# Altium schematic sheet schema_combo_ver.2.SchDoc
size A3; SheetNumber: 1; SheetTotal: 1
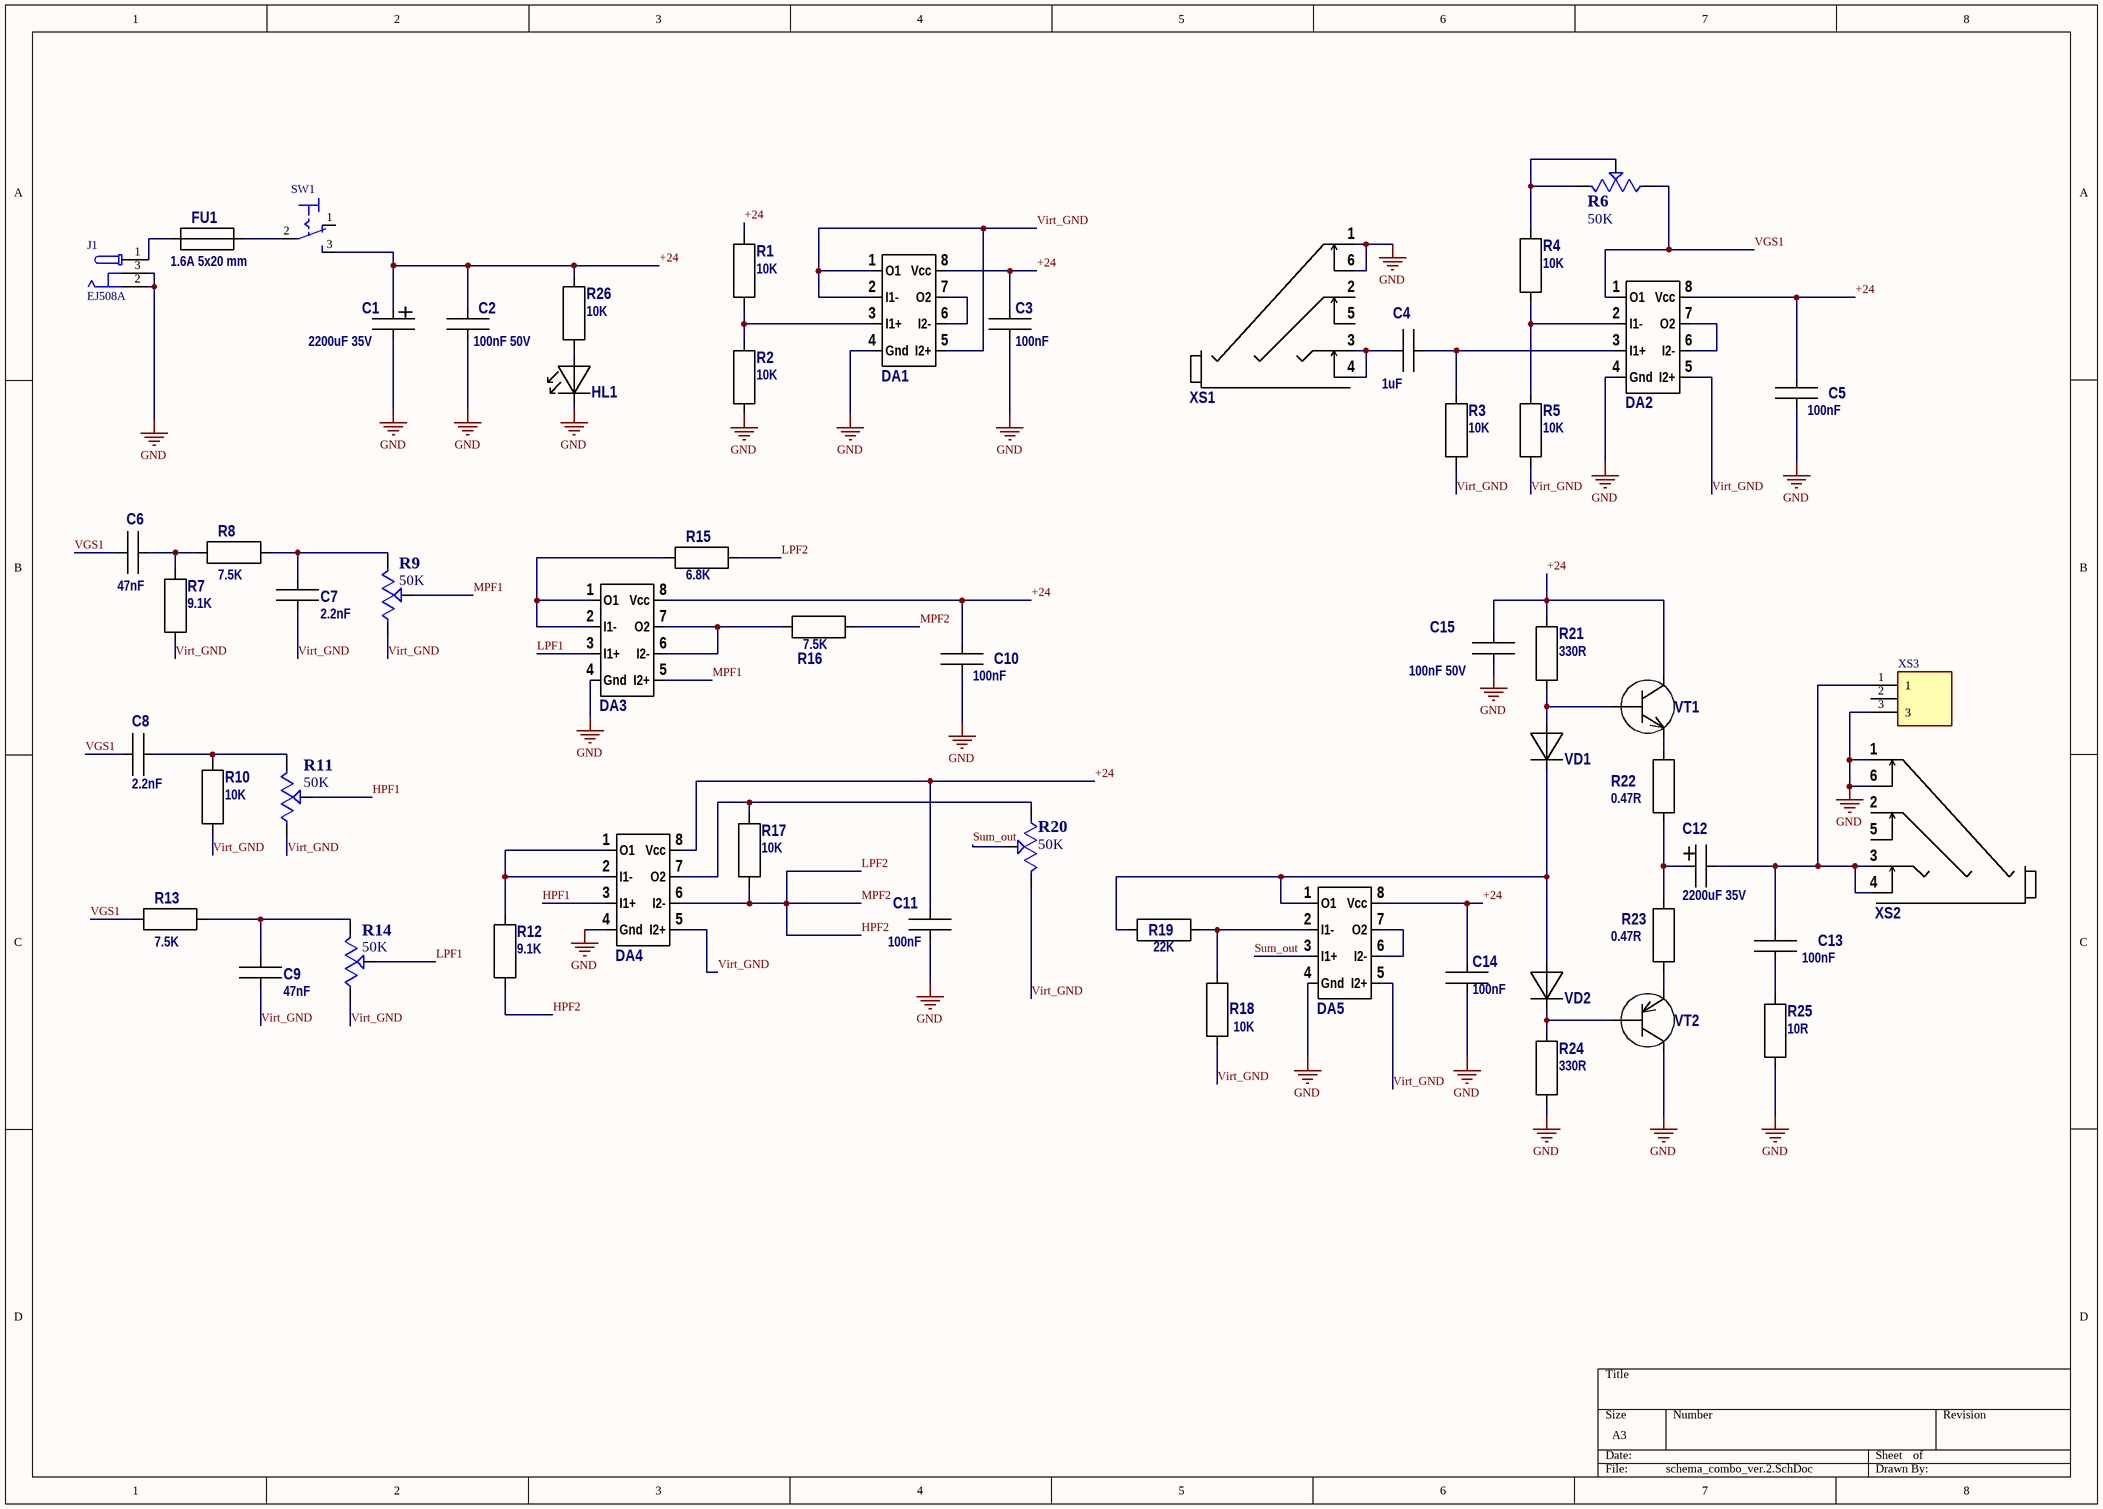
[diagram p0: schema_combo_ver.2.SchDoc]

## Parts
C1  2200uF 35V  [capr- 7.5D16.5H35]
C2  100nF 50V  [C__s 5-d 8-t4]
C3  100nF  [cap 1206 3D]
C4  1uF  [C__s 5-d 5.5-t4]
C5  100nF  [cap 1206 3D]
C6  47nF  [C__s10-d12.4-t4]
C7  2.2nF  [C__s10-d12.4-t4]
C8  2.2nF  [C__s10-d12.4-t4]
C9  47nF  [C__s10-d12.4-t4]
C10  100nF  [cap 1206 3D]
C11  100nF  [cap 1206 3D]
C12  2200uF 35V  [capr- 7.5D16.5H35]
C13  100nF  [C__s 5-d 7-t4]
C14  100nF  [cap 1206 3D]
C15  100nF 50V  [C__s 5-d 8-t4]
DA1  ОУ х 2 (1)  [DIP-8]  (value not drawn)
DA2  ОУ х 2 (1)  [DIP-8]  (value not drawn)
DA3  ОУ х 2 (1)  [DIP-8]  (value not drawn)
DA4  ОУ х 2 (1)  [DIP-8]  (value not drawn)
DA5  ОУ х 2 (1)  [DIP-8]  (value not drawn)
FU1  1.6A 5x20 mm  [FU_FC-001-N(DH)]
HL1  ???  [СД_D5_8.6_Y кр]  (value not drawn)
J1  EJ508A  [MPD_EJ508A]
R1  10K  [Res_1206 3D]
R2  10K  [Res_1206 3D]
R3  10K  [RES 0.25  L10]
R4  10K  [RES 0.25  L10]
R5  10K  [RES 0.25  L10]
R6  50K  [TRIM_WH148-1A-2-18T-L20]
R7  9.1K  [RES 0.25  L10]
R8  7.5K  [RES 0.25  L10]
R9  50K  [TRIM_WH148-1A-2-18T-L20]
R10  10K  [RES 0.25  L10]
R11  50K  [TRIM_WH148-1A-2-18T-L20]
R12  9.1K  [RES 0.25  L 5]
R13  7.5K  [RES 0.25  L10]
R14  50K  [TRIM_WH148-1A-2-18T-L20]
R15  6.8K  [RES 0.25  L 3,75]
R16  7.5K  [RES 0.25  L 3,75]
R17  10K  [RES 0.25  L 3,75]
R18  10K  [RES 0.25  L10]
R19  22K  [RES 0.25  L10]
R20  50K  [TRIM_WH148-1A-2-18T-L20]
R21  330R  [RES 0.5  L12,5]
R22  0.47R  [RES 1,0  L15]
R23  0.47R  [RES 1,0  L15]
R24  330R  [RES 0.5  L12,5]
R25  10R  [RES 0.25  L 5]
R26  10K  [Res_1206 3D]
SW1  MTS103  [MTS103]  (value not drawn)
VD1  Диод.  x1  (2)  [DO-35  (7.5)]  (value not drawn)
VD2  Диод.  x1  (2)  [DO-35  (7.5)]  (value not drawn)
VT1  VT NPN  [TO-220 (Z)]  (value not drawn)
VT2  VT PNP  [TO-220 (Z)]  (value not drawn)
XS1  NYS215  [Гнездо  NYS215]  (value not drawn)
XS2  NYS215  [Гнездо  NYS215]  (value not drawn)
XS3  MKDSN2,5/3-5.08  [PHOENIX_MKDSN2,5/3-5.08]  (value not drawn)

## Nets
GND: C1.1(-) C2.2 C3.2 C5.2 C10.2 C11.2 C14.2 C15.2 DA1.4(Gnd) DA2.4(Gnd) DA3.4(Gnd) DA4.4(Gnd) DA5.4(Gnd) HL1.1(K) J1.2 J1.3 R2.1 R24.1 R25.1 VT2.2(C) XS1.1 XS1.6 XS2.1 XS2.6 XS3.3
+24: C1.2(+) C2.1 C3.1 C5.1 C10.1 C11.1 C14.1 C15.1 DA1.8(Vcc) DA2.8(Vcc) DA3.8(Vcc) DA4.8(Vcc) DA5.8(Vcc) R1.2 R21.2 R26.2 SW1.3(S) VT1.2(C)
HPF1: DA4.3(I1+) R11.2
HPF2: DA4.6(I2-) R12.1 R15.2 R16.2 R17.1  [also labelled LPF2, MPF2]
LPF1: DA3.3(I1+) R14.2
MPF1: DA3.5(I2+) R9.2
Sum_out: DA5.3(I1+) R20.2
VGS1: C6.1 C8.2 DA2.1(O1) R6.1 R13.1
Virt_GND: C7.1 C9.1 DA1.1(O1) DA1.2(I1-) DA1.5(I2+) DA2.5(I2+) DA4.5(I2+) DA5.5(I2+) R3.1 R5.2 R7.1 R9.1 R10.2 R11.1 R14.1 R18.1 R20.1
NetC4_1: C4.1 DA2.3(I1+) R3.2
NetC4_2: C4.2 XS1.3 XS1.4
NetC6_2: C6.2 R7.2 R8.1
NetC7_2: C7.2 R8.2 R9.3
NetC8_1: C8.1 R10.1 R11.3
NetC9_2: C9.2 R13.2 R14.3
NetC12_1: C12.1(-) C13.1 XS2.3 XS2.4 XS3.1
NetC12_2: C12.2(+) R22.2 R23.2
NetC13_2: C13.2 R25.2
NetDA1_3: DA1.3(I1+) R1.1 R2.2
NetDA1_6: DA1.6(I2-) DA1.7(O2)
NetDA2_2: DA2.2(I1-) R4.2 R5.1
NetDA2_6: DA2.6(I2-) DA2.7(O2)
NetDA3_1: DA3.1(O1) DA3.2(I1-) R15.1
NetDA3_6: DA3.6(I2-) DA3.7(O2) R16.1
NetDA4_1: DA4.1(O1) DA4.2(I1-) R12.2
NetDA4_7: DA4.7(O2) R17.2 R20.3
NetDA5_1: DA5.1(O1) R19.1 VD1.1(K) VD2.2(A)
NetDA5_2: DA5.2(I1-) R18.2 R19.2
NetDA5_6: DA5.6(I2-) DA5.7(O2)
NetFU1_1: FU1.1 J1.1
NetFU1_2: FU1.2 SW1.2(P)
NetHL1_2: HL1.2(A) R26.1
NetR4_1: R4.1 R6.2 R6.3
NetR21_1: R21.1 VD1.2(A) VT1.1(B)
NetR22_1: R22.1 VT1.3(E)
NetR23_1: R23.1 VT2.3(E)
NetR24_2: R24.2 VD2.1(K) VT2.1(B)

Not connected (* = marked no-connect by the designer): SW1 1(O); XS1 2 5; XS2 2 5; XS3 2

## Library data of the parts
C1 C12 = C Al R: Конденсатор алюминиевый радиальный
C2 C4 C6-C9 C13 C15 = C_Disk: Конденсатор керамика
C3 C5 C10 C11 C14 = C: Конденсатор керамика
DA1-DA5 = ОУ х 2 (1): NJM4558/4559  LM158х   LM258х   LM358х   LM2904х  TL072х   NE5532x   SA5532x  и другие
FU1 = FU + Clip: Предохранитель плавкий с держателем.
HL1 = D5  H8.6: Св. д. D5 H8.6
J1 = EJ508A: Power Barrel Connector Jack 2.10mm ID _0.083_, 5.50mm OD _0.217_ Through Hole, Right Angle; MF: MPD; Package: Non-Standard MPD; Value: *; SnapEDA_Link: https://www.snapeda.com/parts/EJ508A/MPD%20%28Memory%20Protection%20Devices%29/view-part/474399/?ref=snap; Price: None; MP: EJ508A; Availability: Unavailable
R1-R3 R26 = R: 0805 10K
R4 R5 R7 R8 R10 R12 R13 R15-R17 R21-R25 = R: R4
R6 R9 R11 R14 R20 = WH148-1A-2-18T-L20: 16mm Rotary Potentiometers; MF: Kls electronics; SnapEDA_Link: https://www.snapeda.com/parts/WH148-1A-2-18T-L20/Kls+electronics/view-part/?ref=snap; Package: Package; Value: *; MP: WH148-1A-2-18T-L20; Check_prices: https://www.snapeda.com/parts/WH148-1A-2-18T-L20/Kls+electronics/view-part/?ref=eda
R18 R19 = R: Резисторы плёночные (SMD; МЛТ; С2-33Н; MP9xxx)
SW1 = MTS103: SW TOG 1P2T 6A ON-OFF-ON MINI SOL THR; MF: Not Specified; MP: MTS-103; SnapEDA_Link: https://www.snapeda.com/parts/MTS-103/CIF/view-part/?ref=snap; Package: None; Value: *; Check_prices: https://www.snapeda.com/parts/MTS-103/CIF/view-part/?ref=eda
VD1 VD2 = Диод.  x1  (2): Диод  одиночный
VT1 = VT NPN: Транзистор NPN
VT2 = VT PNP: Транзистор PNP
XS1 XS2 = NYS 215: Гнездо аудио стерео
XS3 = MKDSN2,5/3-5.08: HEADER, PCB, SCREW, 5.08MM, 3WAY; Connector Type: PCB; Series: MKDSN 2, 5; Connector Mounting: PCB; Pitch Spacing: 5....; MF: Phoenix Contact; MP: MKDSN2,5/3-5.08; Availability: Not in stock; SnapEDA_Link: https://www.snapeda.com/parts/MKDSN2,5/3-5.08/Phoenix+Contact/view-part/?ref=snap; Package: None; Check_prices: https://www.snapeda.com/parts/MKDSN2,5/3-5.08/Phoenix+Contact/view-part/?ref=eda; Value: *; Price: None